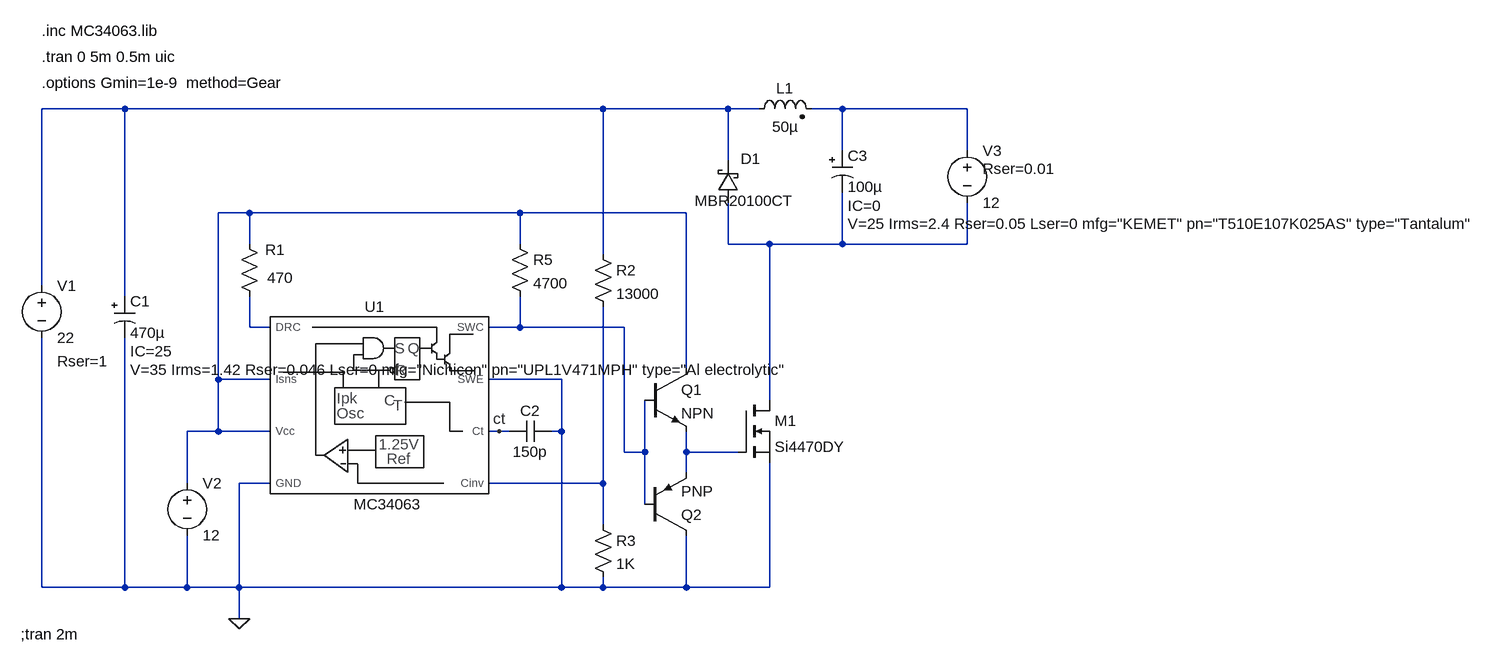
[diagram p0: schematic MC34063_mppt.asc]
MC34063_mppt.asc, the LTspice schematic file:
Version 4
SHEET 1 1736 772
WIRE -464 -208 -592 -208
WIRE 272 -208 -464 -208
WIRE 464 -208 272 -208
WIRE 512 -208 464 -208
WIRE 640 -208 592 -208
WIRE 832 -208 640 -208
WIRE 640 -144 640 -208
WIRE 832 -144 832 -208
WIRE 464 -128 464 -208
WIRE -272 -48 -320 -48
WIRE 144 -48 -272 -48
WIRE 400 -48 144 -48
WIRE -272 0 -272 -48
WIRE 144 0 144 -48
WIRE 464 0 464 -64
WIRE 528 0 464 0
WIRE 640 0 640 -80
WIRE 640 0 528 0
WIRE 832 0 832 -64
WIRE 832 0 640 0
WIRE 272 16 272 -208
WIRE -592 64 -592 -208
WIRE -464 80 -464 -208
WIRE -272 128 -272 80
WIRE -240 128 -272 128
WIRE 144 128 144 80
WIRE 144 128 96 128
WIRE 304 128 144 128
WIRE 400 192 400 -48
WIRE -320 208 -320 -48
WIRE -240 208 -320 208
WIRE 208 208 96 208
WIRE 528 240 528 0
WIRE -320 288 -320 208
WIRE -320 288 -368 288
WIRE -240 288 -320 288
WIRE 112 288 96 288
WIRE 128 288 112 288
WIRE 208 288 208 208
WIRE 208 288 192 288
WIRE 304 320 304 128
WIRE 336 320 336 240
WIRE 336 320 304 320
WIRE 400 320 400 288
WIRE 480 320 400 320
WIRE 400 352 400 320
WIRE -368 368 -368 288
WIRE -240 368 -288 368
WIRE 272 368 272 96
WIRE 272 368 96 368
WIRE 336 400 336 320
WIRE 272 432 272 368
WIRE -592 528 -592 144
WIRE -464 528 -464 144
WIRE -464 528 -592 528
WIRE -368 528 -368 448
WIRE -368 528 -464 528
WIRE -288 528 -288 368
WIRE -288 528 -368 528
WIRE 208 528 208 288
WIRE 208 528 -288 528
WIRE 272 528 272 512
WIRE 272 528 208 528
WIRE 400 528 400 448
WIRE 400 528 272 528
WIRE 528 528 528 336
WIRE 528 528 400 528
WIRE -288 576 -288 528
FLAG -288 576 0
FLAG 112 288 ct
SYMBOL voltage -592 48 R0
WINDOW 123 0 0 Left 0
WINDOW 39 24 132 Left 0
SYMATTR SpiceLine Rser=1
SYMATTR InstName V1
SYMATTR Value 22
SYMBOL res -256 96 R180
WINDOW 0 -39 87 Left 0
WINDOW 3 -52 44 Left 0
SYMATTR InstName R1
SYMATTR Value 470
SYMBOL cap 128 304 R270
WINDOW 0 32 32 VTop 0
WINDOW 3 0 32 VBottom 0
SYMATTR InstName C2
SYMATTR Value 150p
SYMBOL schottky 480 -64 R180
WINDOW 0 -34 67 Left 0
WINDOW 3 -86 3 Left 0
SYMATTR InstName D1
SYMATTR Value MBR20100CT
SYMATTR Description Diode
SYMATTR Type diode
SYMBOL ind2 496 -192 R270
WINDOW 0 32 56 VTop 0
WINDOW 3 4 56 VBottom 0
SYMATTR InstName L1
SYMATTR Value 50µ
SYMATTR SpiceLine Ipk=10 Rser=0.016 Rpar=0 Cpar=0 mfg="Coiltronics" pn="CTX50-10-52"
SYMATTR Type ind
SYMBOL res 256 0 R0
SYMATTR InstName R2
SYMATTR Value 13000
SYMBOL res 256 416 R0
SYMATTR InstName R3
SYMATTR Value 1K
SYMBOL polcap 624 -144 R0
WINDOW 39 24 113 Left 0
WINDOW 40 24 85 Left 0
SYMATTR SpiceLine V=25 Irms=2.4 Rser=0.05 Lser=0 mfg="KEMET" pn="T510E107K025AS" type="Tantalum"
SYMATTR SpiceLine2 IC=0
SYMATTR InstName C3
SYMATTR Value 100µ
SYMBOL polcap -480 80 R0
WINDOW 39 24 113 Left 0
WINDOW 40 24 85 Left 0
SYMATTR SpiceLine V=35 Irms=1.42 Rser=0.046 Lser=0 mfg="Nichicon" pn="UPL1V471MPH" type="Al electrolytic"
SYMATTR SpiceLine2 IC=25
SYMATTR InstName C1
SYMATTR Value 470µ
SYMBOL mc34063 0 224 R0
SYMATTR InstName U1
SYMBOL voltage -368 352 R0
WINDOW 123 0 0 Left 0
WINDOW 39 0 0 Left 0
SYMATTR InstName V2
SYMATTR Value 12
SYMBOL res 128 -16 R0
SYMATTR InstName R5
SYMATTR Value 4700
SYMBOL npn 336 192 R0
SYMATTR InstName Q1
SYMBOL pnp 336 448 M180
SYMATTR InstName Q2
SYMBOL nmos 480 240 R0
SYMATTR InstName M1
SYMATTR Value Si4470DY
SYMBOL voltage 832 -160 R0
WINDOW 123 0 0 Left 0
WINDOW 39 24 44 Left 0
SYMATTR SpiceLine Rser=0.01
SYMATTR InstName V3
SYMATTR Value 12
TEXT -592 -288 Left 0 !.tran 0 5m 0.5m uic
TEXT -592 -328 Left 0 !.inc MC34063.lib
TEXT -592 -248 Left 0 !.options Gmin=1e-9  method=Gear
TEXT -624 600 Left 0 !;tran 2m

The netlist it stands for:
* MC34063_mppt.asc
V1 N001 0 22 Rser=1
R1 N005 N003 470
C2 ct 0 150p
D1 N004 N001 MBR20100CT
L1 N001 N002 50µ Ipk=10 Rser=0.016 Rpar=0 Cpar=0 mfg="Coiltronics" pn="CTX50-10-52"
R2 N001 N008 13000
R3 N008 0 1K
C3 N002 N004 100µ V=25 Irms=2.4 Rser=0.05 Lser=0 mfg="KEMET" pn="T510E107K025AS" type="Tantalum" IC=0
C1 N001 0 470µ V=35 Irms=1.42 Rser=0.046 Lser=0 mfg="Nichicon" pn="UPL1V471MPH" type="Al electrolytic" IC=25
XU1 N006 0 ct 0 N008 N003 N003 N005 MC34063  ; pins SWC SWE Ct GND Cinv Vcc Isns DRC
V2 N003 0 12
R5 N003 N006 4700
Q1 N003 N006 N007 0 NPN
Q2 0 N006 N007 0 PNP
M1 N004 N007 0 0 Si4470DY
V3 N002 N004 12 Rser=0.01
.model D D
.lib standard.dio
.model NPN NPN
.model PNP PNP
.lib standard.bjt
.model NMOS NMOS
.model PMOS PMOS
.lib standard.mos
.tran 0 5m 0.5m uic
.inc MC34063.lib
.options Gmin=1e-9  method=Gear
;tran 2m
.backanno
.end